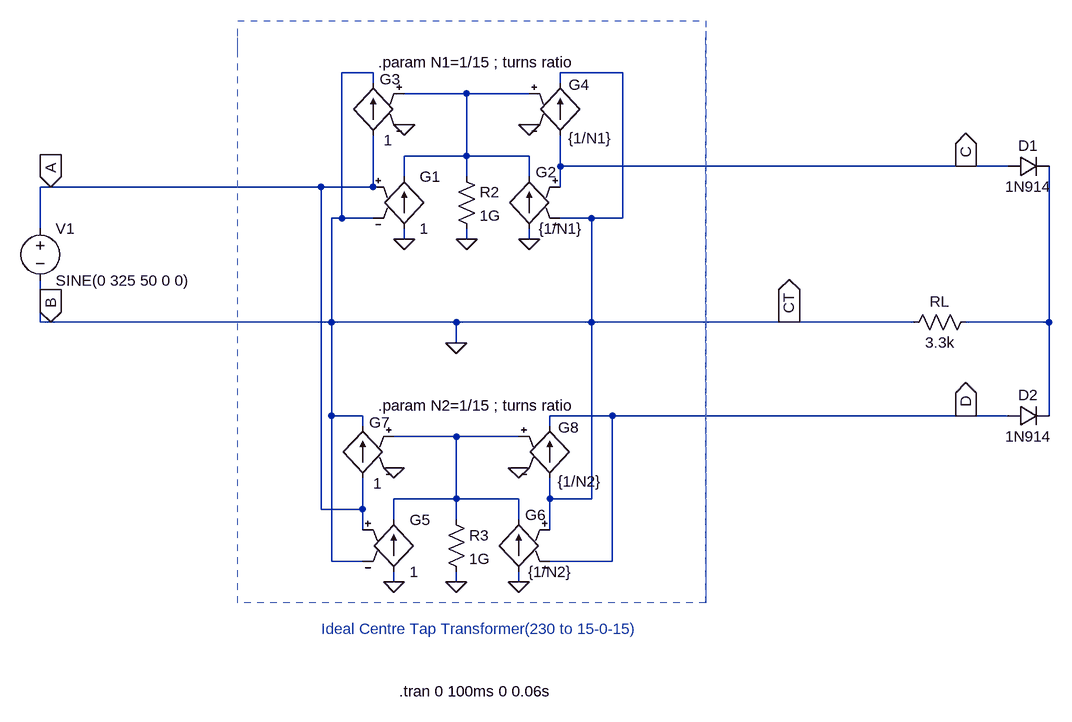
[diagram p0: schematic Lab2_FWR_CT.asc]
Lab2_FWR_CT.asc, the LTspice schematic file:
Version 4
SHEET 1 1848 968
WIRE 160 0 112 0
WIRE 544 0 448 0
WIRE 160 16 160 0
WIRE 448 16 448 0
WIRE 304 32 208 32
WIRE 400 32 304 32
WIRE 304 128 304 32
WIRE 304 128 208 128
WIRE 400 128 304 128
WIRE 448 144 448 96
WIRE 1072 144 448 144
WIRE 1136 144 1072 144
WIRE 208 160 208 128
WIRE 304 160 304 128
WIRE 400 160 400 128
WIRE -336 176 -352 176
WIRE 80 176 -336 176
WIRE 160 176 160 96
WIRE 160 176 80 176
WIRE 448 176 448 144
WIRE 112 224 112 0
WIRE 112 224 96 224
WIRE 160 224 112 224
WIRE 496 224 448 224
WIRE 544 224 544 0
WIRE 544 224 496 224
WIRE -352 240 -352 176
WIRE 208 256 208 240
WIRE 304 256 304 240
WIRE 400 256 400 240
WIRE -352 384 -352 320
WIRE -336 384 -352 384
WIRE 96 384 96 224
WIRE 96 384 -336 384
WIRE 288 384 96 384
WIRE 496 384 496 224
WIRE 496 384 288 384
WIRE 800 384 496 384
WIRE 992 384 800 384
WIRE 1200 384 1200 144
WIRE 1200 384 1072 384
WIRE 288 416 288 384
WIRE 96 528 96 384
WIRE 144 528 96 528
WIRE 528 528 432 528
WIRE 1072 528 528 528
WIRE 1136 528 1072 528
WIRE 1200 528 1200 384
WIRE 144 544 144 528
WIRE 432 544 432 528
WIRE 288 560 192 560
WIRE 384 560 288 560
WIRE 288 656 288 560
WIRE 288 656 192 656
WIRE 384 656 288 656
WIRE 432 656 432 624
WIRE 496 656 496 384
WIRE 496 656 432 656
WIRE 80 672 80 176
WIRE 144 672 144 624
WIRE 144 672 80 672
WIRE 192 688 192 656
WIRE 288 688 288 656
WIRE 384 688 384 656
WIRE 144 704 144 672
WIRE 432 704 432 656
WIRE 96 752 96 528
WIRE 144 752 96 752
WIRE 528 752 528 528
WIRE 528 752 432 752
WIRE 192 784 192 768
WIRE 288 784 288 768
WIRE 384 784 384 768
FLAG 400 256 0
FLAG 208 256 0
FLAG 208 80 0
FLAG 400 80 0
FLAG 304 256 0
FLAG 288 416 0
FLAG 384 784 0
FLAG 192 784 0
FLAG 192 608 0
FLAG 384 608 0
FLAG 288 784 0
FLAG -336 176 A
IOPIN -336 176 In
FLAG -336 384 B
IOPIN -336 384 In
FLAG 1072 144 C
IOPIN 1072 144 Out
FLAG 800 384 CT
IOPIN 800 384 Out
FLAG 1072 528 D
IOPIN 1072 528 Out
SYMBOL g 208 144 R0
SYMATTR InstName G1
SYMATTR Value 1
SYMBOL g 400 144 M0
WINDOW 0 -10 9 Right 2
WINDOW 3 -15 96 Right 2
SYMATTR InstName G2
SYMATTR Value {1/N1}
SYMBOL g 160 0 M0
WINDOW 0 -10 10 Right 2
WINDOW 3 -16 104 Right 2
SYMATTR InstName G3
SYMATTR Value 1
SYMBOL g 448 0 R0
WINDOW 0 13 18 Left 2
WINDOW 3 12 101 Left 2
SYMATTR InstName G4
SYMATTR Value {1/N1}
SYMBOL res 288 144 R0
SYMATTR InstName R2
SYMATTR Value 1G
SYMBOL g 192 672 R0
SYMATTR InstName G5
SYMATTR Value 1
SYMBOL g 384 672 M0
WINDOW 0 -10 9 Right 2
WINDOW 3 -15 96 Right 2
SYMATTR InstName G6
SYMATTR Value {1/N2}
SYMBOL g 144 528 M0
WINDOW 0 -10 10 Right 2
WINDOW 3 -16 104 Right 2
SYMATTR InstName G7
SYMATTR Value 1
SYMBOL g 432 528 R0
WINDOW 0 13 18 Left 2
WINDOW 3 12 101 Left 2
SYMATTR InstName G8
SYMATTR Value {1/N2}
SYMBOL res 272 672 R0
SYMATTR InstName R3
SYMATTR Value 1G
SYMBOL diode 1136 160 R270
WINDOW 0 32 32 VTop 2
WINDOW 3 0 32 VBottom 2
SYMATTR InstName D1
SYMATTR Value 1N914
SYMBOL diode 1136 544 R270
WINDOW 0 32 32 VTop 2
WINDOW 3 0 32 VBottom 2
SYMATTR InstName D2
SYMATTR Value 1N914
SYMBOL voltage -352 224 R0
WINDOW 123 0 0 Left 0
WINDOW 39 0 0 Left 0
SYMATTR InstName V1
SYMATTR Value SINE(0 325 50 0 0)
SYMBOL res 976 400 R270
WINDOW 0 32 56 VTop 2
WINDOW 3 0 56 VBottom 2
SYMATTR InstName RL
SYMATTR Value 3.3k
TEXT 200 952 Left 2 !.tran 0 100ms 0 0.06s
TEXT 328 872 Bottom 2 ;Ideal Centre Tap Transformer(230 to 15-0-15)
TEXT 168 -16 Left 2 !.param N1=1/15 ; turns ratio
TEXT 168 512 Left 2 !.param N2=1/15 ; turns ratio
LINE Normal -48 816 -48 -64 1
LINE Normal 672 816 -48 816 1
LINE Normal 672 -64 672 816 1
LINE Normal 672 816 672 -64 2
LINE Normal 672 -80 672 816 2
LINE Normal 672 -80 672 -80 2
LINE Normal -48 -80 672 -80 1
LINE Normal -48 -32 -48 -80 2
LINE Normal -48 -32 -48 -32 2

The netlist it stands for:
* Lab2_FWR_CT.asc
G1 0 N001 A 0 1
G2 0 N001 C 0 {1/N1}
G3 A 0 N001 0 1
G4 C 0 N001 0 {1/N1}
R2 N001 0 1G
G5 0 N003 A 0 1
G6 0 N003 0 D {1/N2}
G7 A 0 N003 0 1
G8 0 D N003 0 {1/N2}
R3 N003 0 1G
D1 C N002 1N914
D2 D N002 1N914
V1 A 0 SINE(0 325 50 0 0)
RL 0 N002 3.3k
.model D D
.lib standard.dio
.tran 0 100ms 0 0.06s
* Ideal Centre Tap Transformer(230 to 15-0-15)
.param N1=1/15 ; turns ratio
.param N2=1/15 ; turns ratio
.backanno
.end

* Results of the author's LTspice run, read from the files saved beside the schematic
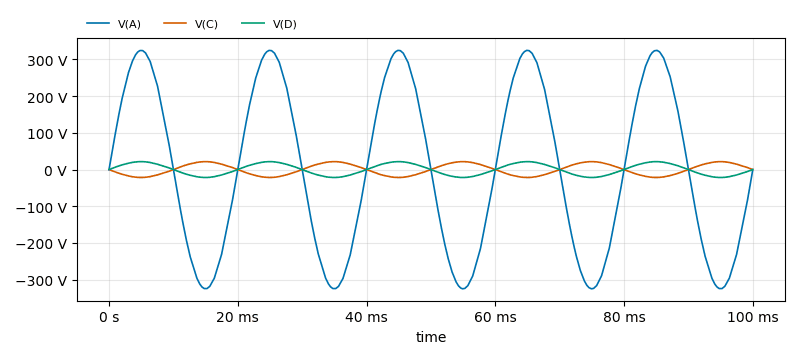
[diagram p1: Transient Analysis of Lab2_FWR_CT.asc, plotted from the saved traces]
* Transient Analysis, 1 run:
*   V(A): min -324.9 V, max 324.8 V, average 78.05 mV, rms 230.4 V, last 0 V
*   V(C): min -21.58 V, max 21.6 V, average -14.13 mV, rms 15.14 V, last 0 V
*   V(D): min -21.6 V, max 21.58 V, average 14.13 mV, rms 15.14 V, last 0 V